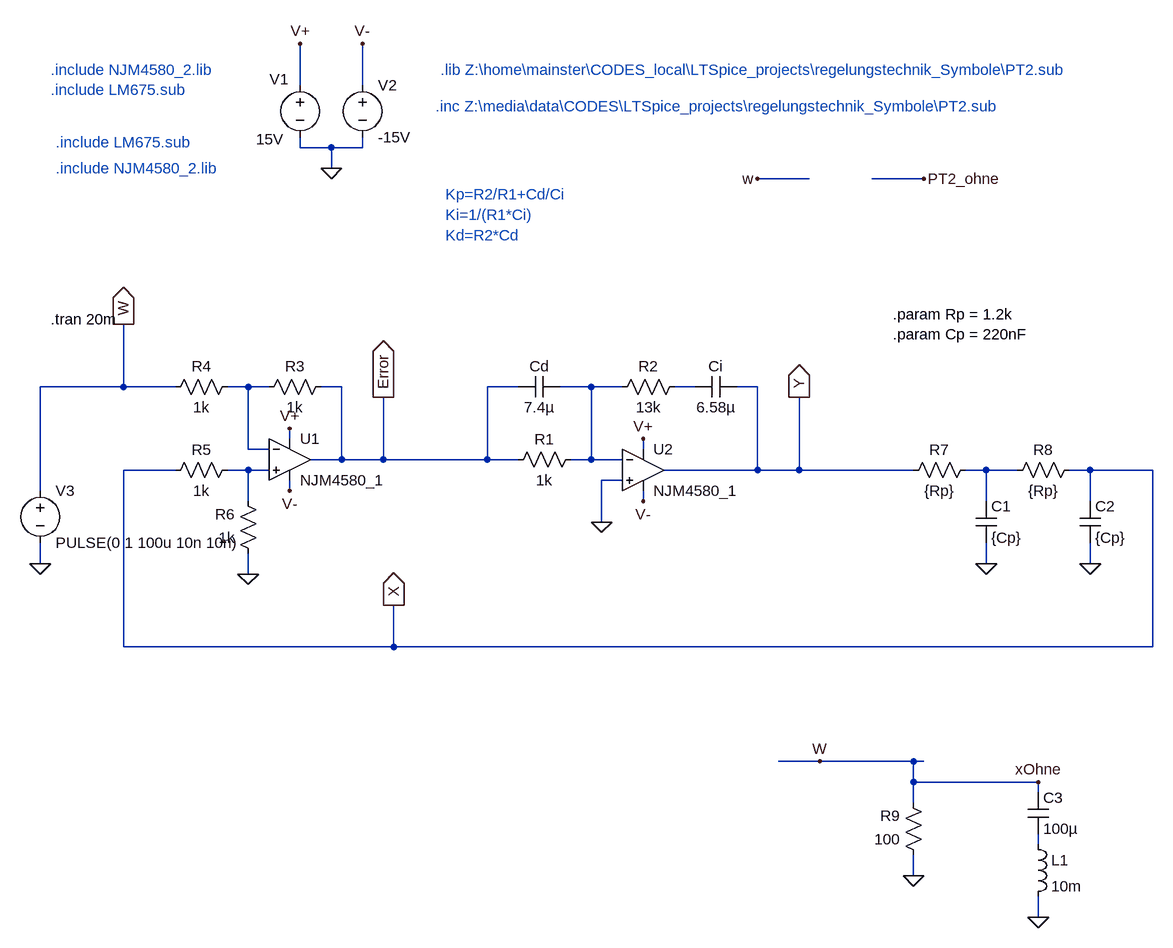
[diagram p0: schematic PID_single_OpAmp.asc]
PID_single_OpAmp.asc, the LTspice schematic file:
Version 4
SHEET 1 2100 1220
WIRE 704 -80 704 -144
WIRE 800 -80 800 -144
WIRE 704 16 704 0
WIRE 752 16 704 16
WIRE 800 16 800 0
WIRE 800 16 752 16
WIRE 752 48 752 16
WIRE 1488 64 1408 64
WIRE 1664 64 1584 64
WIRE 432 384 432 288
WIRE 432 384 304 384
WIRE 512 384 432 384
WIRE 624 384 592 384
WIRE 656 384 624 384
WIRE 768 384 736 384
WIRE 1040 384 992 384
WIRE 1152 384 1104 384
WIRE 1200 384 1152 384
WIRE 1312 384 1280 384
WIRE 1408 384 1376 384
WIRE 688 464 688 448
WIRE 624 480 624 384
WIRE 656 480 624 480
WIRE 1232 480 1232 464
WIRE 768 496 768 384
WIRE 768 496 720 496
WIRE 832 496 832 400
WIRE 832 496 768 496
WIRE 992 496 992 384
WIRE 992 496 832 496
WIRE 1040 496 992 496
WIRE 1152 496 1152 384
WIRE 1152 496 1120 496
WIRE 1200 496 1152 496
WIRE 512 512 432 512
WIRE 624 512 592 512
WIRE 656 512 624 512
WIRE 1408 512 1408 384
WIRE 1408 512 1264 512
WIRE 1472 512 1472 400
WIRE 1472 512 1408 512
WIRE 1648 512 1472 512
WIRE 1760 512 1728 512
WIRE 1808 512 1760 512
WIRE 1920 512 1888 512
WIRE 2016 512 1920 512
WIRE 1200 528 1168 528
WIRE 304 544 304 384
WIRE 688 544 688 528
WIRE 624 560 624 512
WIRE 1232 560 1232 544
WIRE 1760 560 1760 512
WIRE 1920 560 1920 512
WIRE 1168 592 1168 528
WIRE 304 656 304 624
WIRE 1760 656 1760 624
WIRE 1920 656 1920 624
WIRE 624 672 624 640
WIRE 432 784 432 512
WIRE 848 784 848 720
WIRE 848 784 432 784
WIRE 2016 784 2016 512
WIRE 2016 784 848 784
WIRE 1504 960 1440 960
WIRE 1648 960 1504 960
WIRE 1664 960 1648 960
WIRE 1648 992 1648 960
WIRE 1840 992 1648 992
WIRE 1840 1008 1840 992
WIRE 1648 1024 1648 992
WIRE 1840 1088 1840 1072
WIRE 1648 1136 1648 1104
WIRE 1840 1200 1840 1168
FLAG 304 656 0
FLAG 752 48 0
FLAG 704 -144 V+
FLAG 800 -144 V-
FLAG 1232 560 V-
FLAG 1232 464 V+
FLAG 1168 592 0
FLAG 688 544 V-
FLAG 688 448 V+
FLAG 624 672 0
FLAG 832 400 Error
IOPIN 832 400 Out
FLAG 432 288 W
IOPIN 432 288 Out
FLAG 1472 400 Y
IOPIN 1472 400 Out
FLAG 848 720 X
IOPIN 848 720 Out
FLAG 1408 64 w
FLAG 1664 64 PT2_ohne
FLAG 1760 656 0
FLAG 1920 656 0
FLAG 1840 1200 0
FLAG 1504 960 W
FLAG 1840 992 xOhne
FLAG 1648 1136 0
SYMBOL voltage 704 -96 R0
WINDOW 123 0 0 Left 2
WINDOW 39 0 0 Left 2
WINDOW 0 -47 7 Left 2
WINDOW 3 -68 99 Left 2
SYMATTR InstName V1
SYMATTR Value 15V
SYMBOL voltage 800 -96 R0
WINDOW 123 0 0 Left 2
WINDOW 39 0 0 Left 2
SYMATTR InstName V2
SYMATTR Value -15V
SYMBOL voltage 304 528 R0
WINDOW 123 0 0 Left 2
WINDOW 39 0 0 Left 2
SYMATTR InstName V3
SYMATTR Value PULSE(0 1 100u 10n 10n)
SYMBOL res 1296 368 R90
WINDOW 0 0 56 VBottom 2
WINDOW 3 32 56 VTop 2
SYMATTR InstName R2
SYMATTR Value 13k
SYMBOL res 1136 480 R90
WINDOW 0 0 56 VBottom 2
WINDOW 3 32 56 VTop 2
SYMATTR InstName R1
SYMATTR Value 1k
SYMBOL cap 1104 368 R90
WINDOW 0 0 32 VBottom 2
WINDOW 3 32 32 VTop 2
SYMATTR InstName Cd
SYMATTR Value 7.4µ
SYMBOL cap 1376 368 R90
WINDOW 0 0 32 VBottom 2
WINDOW 3 32 32 VTop 2
SYMATTR InstName Ci
SYMATTR Value 6.58µ
SYMBOL res 752 368 R90
WINDOW 0 0 56 VBottom 2
WINDOW 3 32 56 VTop 2
SYMATTR InstName R3
SYMATTR Value 1k
SYMBOL res 608 368 R90
WINDOW 0 0 56 VBottom 2
WINDOW 3 32 56 VTop 2
SYMATTR InstName R4
SYMATTR Value 1k
SYMBOL res 608 496 R90
WINDOW 0 0 56 VBottom 2
WINDOW 3 32 56 VTop 2
SYMATTR InstName R5
SYMATTR Value 1k
SYMBOL res 640 656 R180
WINDOW 0 36 76 Left 2
WINDOW 3 36 40 Left 2
SYMATTR InstName R6
SYMATTR Value 1k
SYMBOL res 1744 496 R90
WINDOW 0 0 56 VBottom 2
WINDOW 3 32 56 VTop 2
SYMATTR InstName R7
SYMATTR Value {Rp}
SYMBOL cap 1744 560 R0
SYMATTR InstName C1
SYMATTR Value {Cp}
SYMBOL res 1904 496 R90
WINDOW 0 0 56 VBottom 2
WINDOW 3 32 56 VTop 2
SYMATTR InstName R8
SYMATTR Value {Rp}
SYMBOL cap 1904 560 R0
SYMATTR InstName C2
SYMATTR Value {Cp}
SYMBOL res 1664 1120 R180
WINDOW 0 36 76 Left 2
WINDOW 3 36 40 Left 2
SYMATTR InstName R9
SYMATTR Value 100
SYMBOL cap 1824 1008 R0
SYMATTR InstName C3
SYMATTR Value 100µ
SYMBOL ind 1824 1072 R0
SYMATTR InstName L1
SYMATTR Value 10m
SYMBOL NJM4580_1 688 432 R0
SYMATTR InstName U1
SYMBOL NJM4580_1 1232 448 R0
SYMATTR InstName U2
TEXT 328 8 Left 2 ;.include LM675.sub
TEXT 928 88 Left 2 ;Kp=R2/R1+Cd/Ci\nKi=1/(R1*Ci)\nKd=R2*Cd
TEXT 320 280 Left 2 !.tran 20m
TEXT 912 -48 Left 2 ;.inc Z:\\media\\data\\CODES\\LTSpice_projects\\regelungstechnik_Symbole\\PT2.sub
TEXT 328 48 Left 2 ;.include NJM4580_2.lib
TEXT 320 -104 Left 2 ;.include NJM4580_2.lib\n.include LM675.sub
TEXT 920 -104 Left 2 ;.lib Z:\\home\\mainster\\CODES_local\\LTSpice_projects\\regelungstechnik_Symbole\\PT2.sub
TEXT 1616 272 Left 2 !.param Rp = 1.2k\n.param Cp = 220nF

The netlist it stands for:
* PID_single_OpAmp.asc
V1 V+ 0 15V
V2 V- 0 -15V
V3 xOhne 0 PULSE(0 1 100u 10n 10n)
R2 N003 N002 13k
R1 N002 Error 1k
Cd N002 Error 7.4µ
Ci Y N003 6.58µ
R3 Error N001 1k
R4 N001 xOhne 1k
R5 N004 X 1k
R6 0 N004 1k
R7 N005 Y {Rp}
C1 N005 0 {Cp}
R8 X N005 {Rp}
C2 X 0 {Cp}
R9 0 xOhne 100
C3 xOhne N006 100µ
L1 N006 0 10m
* U1: NJM4580_1 (symbol NJM4580_1 not available, pins judged from their places): In+=N004 In-=N001 V+=V+ V-=V- OUT=Error
* U2: NJM4580_1 (symbol NJM4580_1 not available, pins judged from their places): In+=0 In-=N002 V+=V+ V-=V- OUT=Y
* .include LM675.sub
* Kp=R2/R1+Cd/Ci
* Ki=1/(R1*Ci)
* Kd=R2*Cd
.tran 20m
* .inc Z:\media\data\CODES\LTSpice_projects\regelungstechnik_Symbole\PT2.sub
* .include NJM4580_2.lib
* .include NJM4580_2.lib
* .include LM675.sub
* .lib Z:\home\mainster\CODES_local\LTSpice_projects\regelungstechnik_Symbole\PT2.sub
.param Rp = 1.2k
.param Cp = 220nF
.backanno
.end